# Altium schematic sheet MCU_CORE.SchDoc
size A2
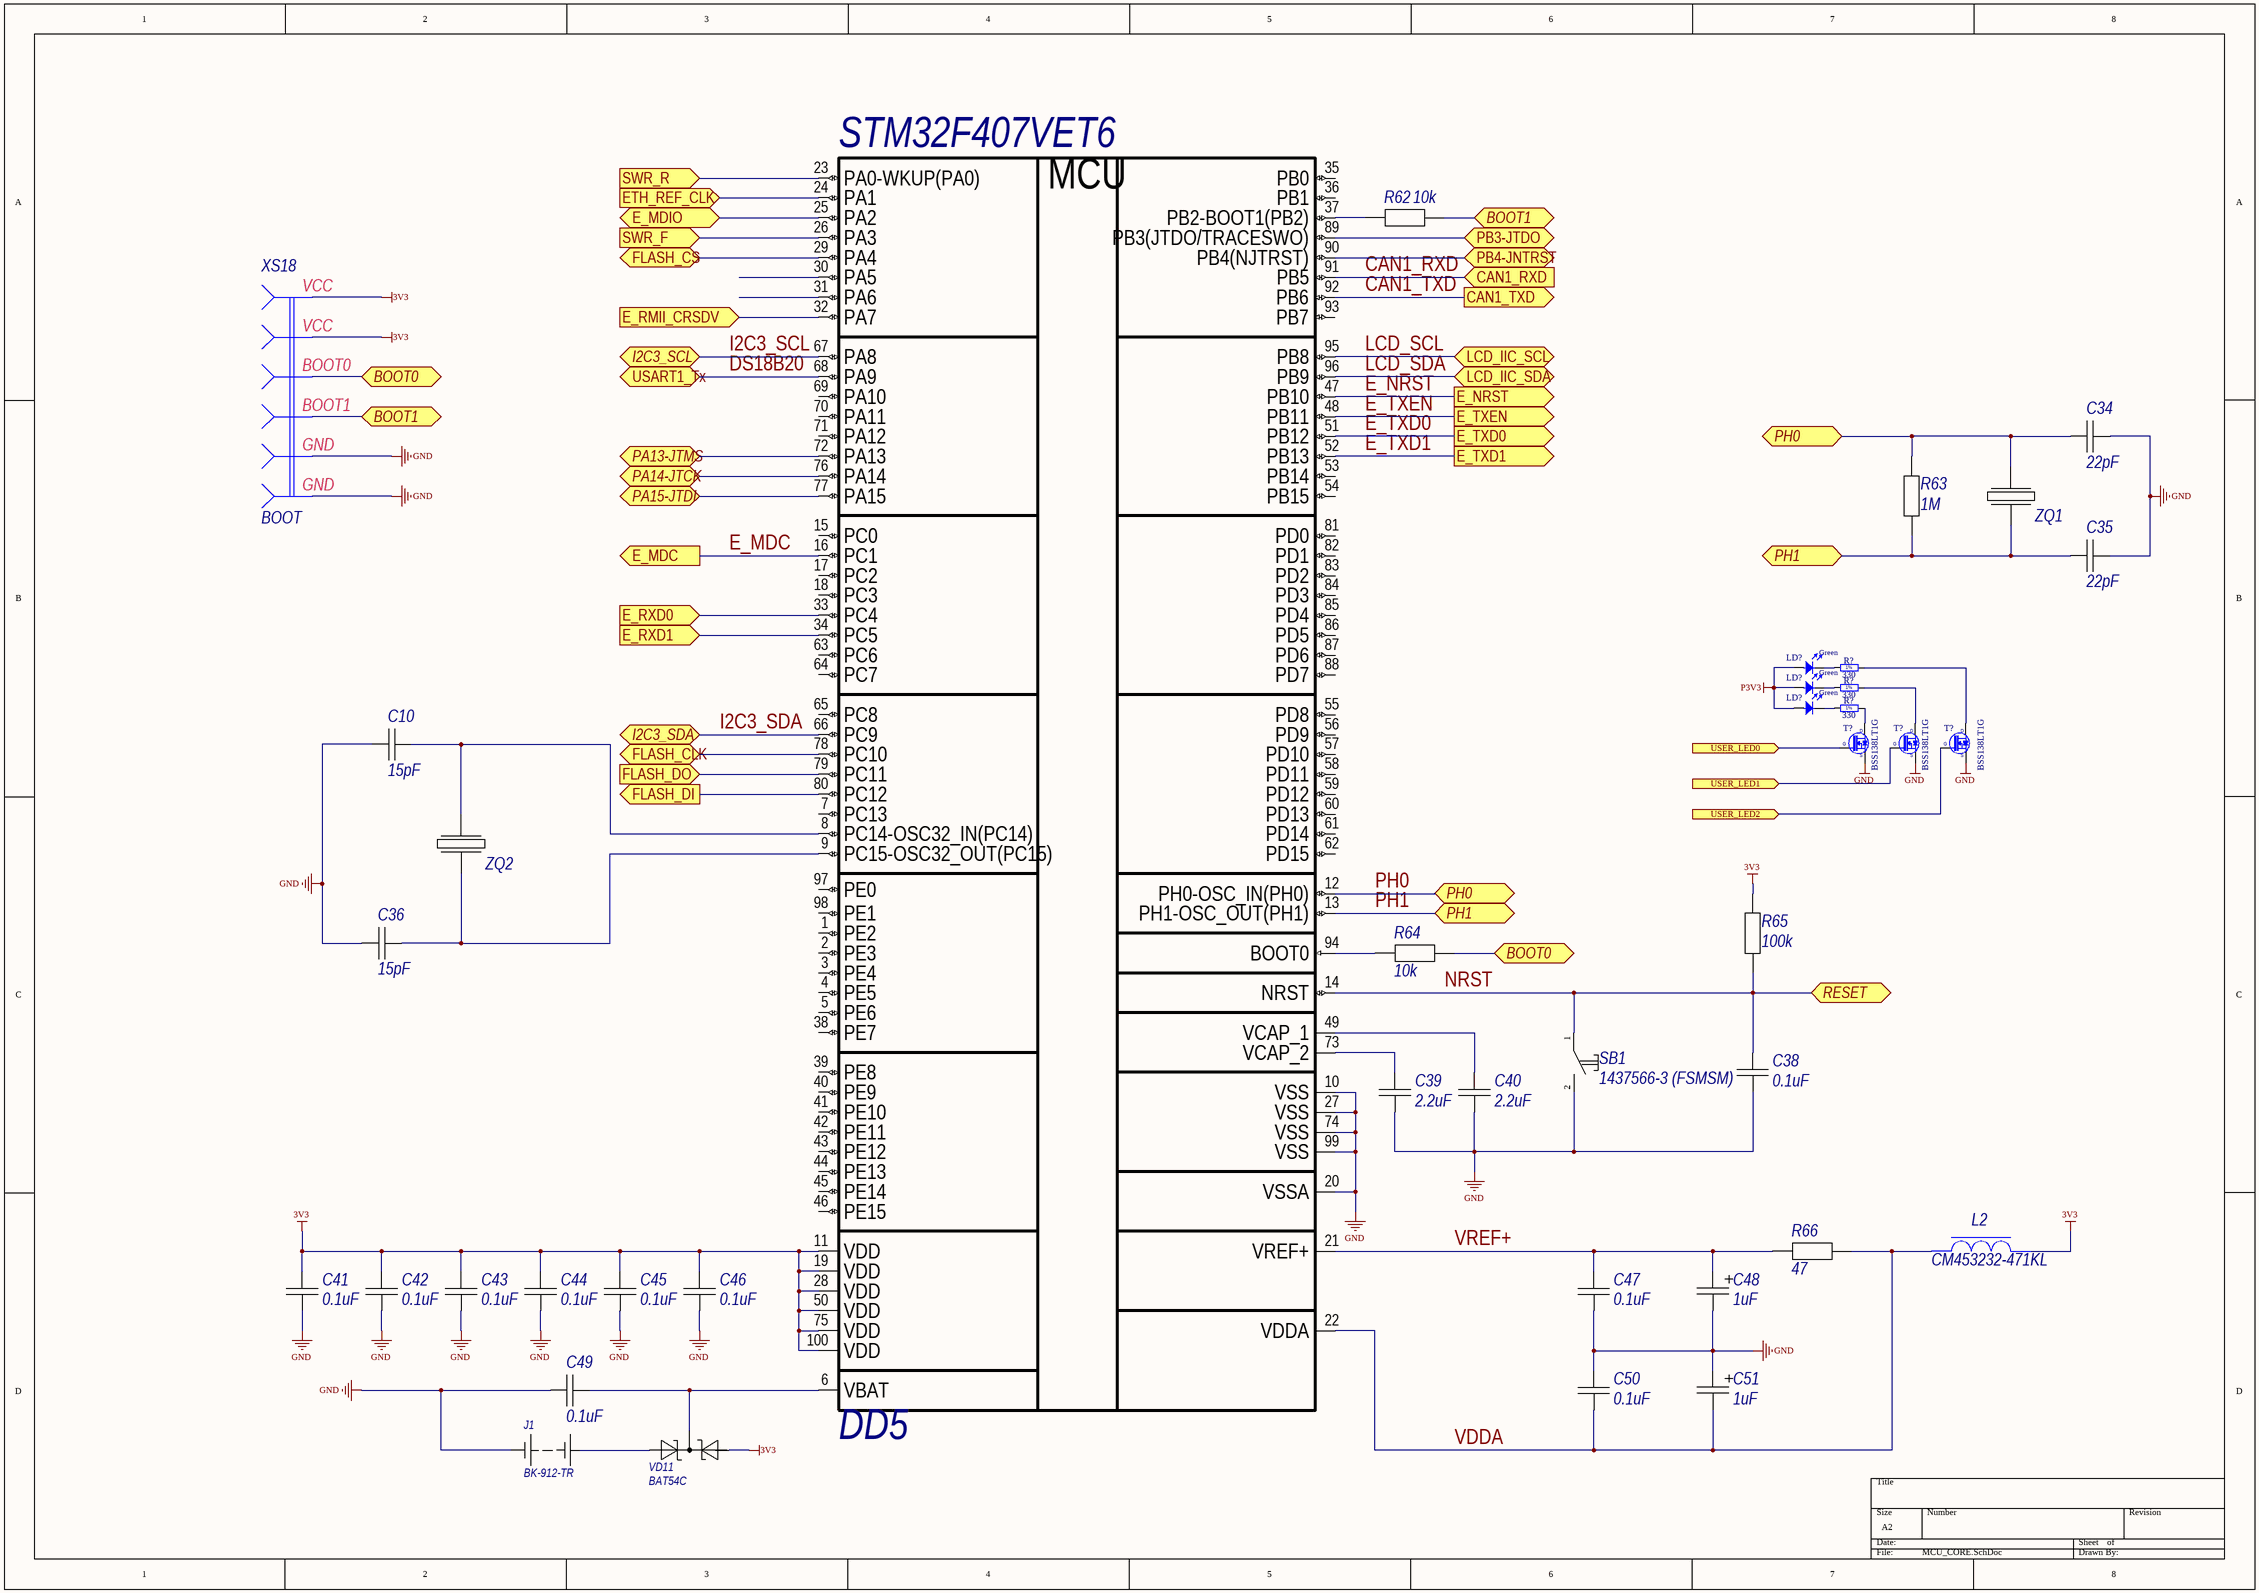
[diagram p0: MCU_CORE.SchDoc]

## Parts
(Parts that share a designator on the sheet are numbered #1, #2 ... from top to bottom, then left to right.)
C10  15pF  [C0805C]
C34  22pF  [C0805C]
C35  22pF  [C0805C]
C36  15pF  [C0805C]
C38  0.1uF  [C0805C]
C39  2.2uF  [C0805C]
C40  2.2uF  [C0805C]
C41  0.1uF  [C0805C]
C42  0.1uF  [C0805C]
C43  0.1uF  [C0805C]
C44  0.1uF  [C0805C]
C45  0.1uF  [C0805C]
C46  0.1uF  [C0805C]
C47  0.1uF  [C0805C]
C48  1uF  [TECAP_A]
C49  0.1uF  [C0805C]
C50  0.1uF  [C0805C]
C51  1uF  [TECAP_A]
DD5  STM32F407VET6  [STM-LQFP100_V]
J1  BK-912-TR  [BK-912-TR]
L2  CM453232-471KL  [INDPM4532]
LD?#1  Green  [LED_AVAGO_HSME-C110]
LD?#2  Green  [LED_AVAGO_HSME-C110]
LD?#3  Green  [LED_AVAGO_HSME-C110]
R62  10k  [C0805R]
R63  1M  [C0805R]
R64  10k  [C0805R]
R65  100k  [C0805R]
R66  47  [C0805R]
R?#1  330  [RESC1608X55N]
R?#2  330  [RESC1608X55N]
R?#3  330  [RESC1608X55N]
SB1  1437566-3 (FSMSM)  [1437566-3]
T?#1  BSS138LT1G  [SOT95P240X110-3N]
T?#2  BSS138LT1G  [SOT95P240X110-3N]
T?#3  BSS138LT1G  [SOT95P240X110-3N]
VD11  BAT54C  [BAT54C_SOT23-3]
XS18  BOOT  [PLD2-3]
ZQ1  HC49SM  [HC49SM]  (value not drawn)
ZQ2  FC135  [FC-135]  (value not drawn)

## Ports
BOOT0 (bidir), BOOT1 (bidir), CAN1_RXD (in), CAN1_TXD (out), E_MDC (out), E_MDIO (bidir), E_NRST (out), E_RMII_CRSDV (in), E_RXD0 (in), E_RXD1 (in), E_TXD0 (out), E_TXD1 (out), E_TXEN (out), ETH_REF_CLK (in), FLASH_CLK (bidir), FLASH_CS (bidir), FLASH_DI (out), FLASH_DO (in), I2C3_SCL (bidir), I2C3_SDA (bidir), LCD_IIC_SCL (bidir), LCD_IIC_SDA (bidir), PA13-JTMS (bidir), PA14-JTCK (bidir), PA15-JTDI (bidir), PB3-JTDO (bidir), PB4-JNTRST (bidir), PH0 (bidir), PH1 (bidir), RESET (bidir), SWR_F (in), SWR_R (in), USART1_Tx (bidir), USER_LED0 (in), USER_LED1 (in), USER_LED2 (in)

## Nets
3V3: C41.2 C42.2 C43.2 C44.2 C45.2 C46.2 DD5.11(VDD) DD5.19(VDD) DD5.28(VDD) DD5.50(VDD) DD5.75(VDD) DD5.100(VDD) L2.2 R65.1 VD11.2(C) XS18.1 XS18.2
GND: C10.1 C34.1 C35.1 C36.1 C38.1 C39.1 C40.1 C41.1 C42.1 C43.1 C44.1 C45.1 C46.1 C47.1 C48.2 C49.2 C50.2 C51.1 DD5.10(VSS) DD5.20(VSSA) DD5.27(VSS) DD5.74(VSS) DD5.99(VSS) J1.2(-) SB1.2 T?#1.2(S) T?#2.2(S) T?#3.2(S) XS18.5 XS18.6
P3V3: LD?#1.2(A) LD?#2.2(A) LD?#3.2(A)
BOOT0: R64.1 XS18.3 ; port BOOT0
BOOT1: R62.1 XS18.4 ; port BOOT1
CAN1_RXD: DD5.91(PB5) ; port CAN1_RXD
CAN1_TXD: DD5.92(PB6) ; port CAN1_TXD
DS18B20: DD5.68(PA9) ; port USART1_Tx
E_MDC: DD5.16(PC1) ; port E_MDC
E_MDIO: DD5.25(PA2) ; port E_MDIO
E_NRST: DD5.47(PB10) ; port E_NRST
E_RMII_CRSDV: DD5.32(PA7) ; port E_RMII_CRSDV
E_RXD0: DD5.33(PC4) ; port E_RXD0
E_RXD1: DD5.34(PC5) ; port E_RXD1
E_TXD0: DD5.51(PB12) ; port E_TXD0
E_TXD1: DD5.52(PB13) ; port E_TXD1
E_TXEN: DD5.48(PB11) ; port E_TXEN
ETH_REF_CLK: DD5.24(PA1) ; port ETH_REF_CLK
FLASH_CLK: DD5.78(PC10) ; port FLASH_CLK
FLASH_CS: DD5.29(PA4) ; port FLASH_CS
FLASH_DI: DD5.80(PC12) ; port FLASH_DI
FLASH_DO: DD5.79(PC11) ; port FLASH_DO
I2C3_SCL: DD5.67(PA8) ; port I2C3_SCL
I2C3_SDA: DD5.66(PC9) ; port I2C3_SDA
LCD_SCL: DD5.95(PB8) ; port LCD_IIC_SCL
LCD_SDA: DD5.96(PB9) ; port LCD_IIC_SDA
NRST: C38.2 DD5.14(NRST) R65.2 SB1.1 ; port RESET
PA13-JTMS: DD5.72(PA13) ; port PA13-JTMS
PA14-JTCK: DD5.76(PA14) ; port PA14-JTCK
PA15-JTDI: DD5.77(PA15) ; port PA15-JTDI
PB3-JTDO: DD5.89(PB3(JTDO/TRACESWO)) ; port PB3-JTDO
PB4-JNTRST: DD5.90(PB4(NJTRST)) ; port PB4-JNTRST
PH0: C34.2 DD5.12(PH0-OSC_IN(PH0)) R63.1 ZQ1.2 ; port PH0
PH1: C35.2 DD5.13(PH1-OSC_OUT(PH1)) R63.2 ZQ1.1 ; port PH1
SWR_F: DD5.26(PA3) ; port SWR_F
SWR_R: DD5.23(PA0-WKUP(PA0)) ; port SWR_R
USER_LED0: T?#1.1(G) ; port USER_LED0
USER_LED1: T?#2.1(G) ; port USER_LED1
USER_LED2: T?#3.1(G) ; port USER_LED2
VDDA: C50.1 C51.2 DD5.22(VDDA) L2.1 R66.1
VREF+: C47.2 C48.1 DD5.21(VREF+) R66.2
NetC10_2: C10.2 DD5.8(PC14-OSC32_IN(PC14)) ZQ2.2
NetC36_2: C36.2 DD5.9(PC15-OSC32_OUT(PC15)) ZQ2.1
NetC39_2: C39.2 DD5.73(VCAP_2)
NetC40_2: C40.2 DD5.49(VCAP_1)
NetC49_1: C49.1 DD5.6(VBAT) VD11.3(AC)
NetDD5_37: DD5.37(PB2-BOOT1(PB2)) R62.2
NetDD5_94: DD5.94(BOOT0) R64.2
NetJ1_1: J1.1(+) VD11.1(А1)
NetLD?#1_1: LD?#1.1(C) R?#1.1
NetLD?#2_1: LD?#2.1(C) R?#2.1
NetLD?#3_1: LD?#3.1(C) R?#3.1
NetR?#1_2: R?#1.2 T?#3.3(D)
NetR?#2_2: R?#2.2 T?#2.3(D)
NetR?#3_2: R?#3.2 T?#1.3(D)

Not connected (* = marked no-connect by the designer): DD5 1(PE2) 2(PE3) 3(PE4) 4(PE5) 5(PE6) 7(PC13) 15(PC0) 17(PC2) 18(PC3) 30(PA5) 31(PA6) 35(PB0) 36(PB1) 38(PE7) 39(PE8) 40(PE9) 41(PE10) 42(PE11) 43(PE12) 44(PE13) 45(PE14) 46(PE15) 53(PB14) 54(PB15) 55(PD8) 56(PD9) 57(PD10) 58(PD11) 59(PD12) 60(PD13) 61(PD14) 62(PD15) 63(PC6) 64(PC7) 65(PC8) 69(PA10) 70(PA11) 71(PA12) 81(PD0) 82(PD1) 83(PD2) 84(PD3) 85(PD4) 86(PD5) 87(PD6) 88(PD7) 93(PB7) 97(PE0) 98(PE1)

## Notes on the sheet
- (in symbol CONNECT_BOOT) VCC; BOOT0; BOOT1; GND
- (in symbol R0603_330R_1%_0.1W_100PPM) 1%
- (in symbol STM32F407VET6) MCU

## Library data of the parts
C10 C34-C36 C38-C47 C49 C50 = CAP_0805: Type: Конденсатор; Published: 18.05.2010; Publisher: Andrew Danich
C48 C51 = CAP_TECAP_A: Type: Конденсатор; Published: 20.08.2010; Publisher: Andrew Danich
DD5 = STM32F407VET6: ARM Cortex-M4 32-bit MCU+FPU, 210 DMIPS, 512 kB Flash, 192 kB Internal RAM, 82 I/Os, 100-pin LQFP, -40 to 85 degC, Tray; Manufacturer: STMicroelectronics; D/A Converter: 2x12-bit; FLASH Size (Prog) (kB): 512; I/Os (High Current): 82; Internal RAM Size (kB): 192; Operating Frequency(F) (Processor speed) (MHz): 168; Supply Voltage(Vcc) max (V): 3.6; Supply Voltage(Vcc) min (V): 1.8; DatasheetVersion: Rev. 4; PackageVersion: Rev. 1, 06/2013; PackageReference: LQFP100; PackageDescription: 100-Pin Low Profile Quad Flat Package, 14 x 14 mm Body, 0.5 mm Pitch; Supplier 1: Digi-Key; Supplier Part Number 1: 497-12075-ND; Supplier 2: Farnell; Supplier Part Number 2: 2064367; Supplier 3: Newark; Supplier Part Number 3: 73T2332; Supplier 4: Mouser; Supplier Part Number 4: 511-STM32F407VET6; Core: ARM Cortex-M4; Packing: Tray; Mounting Technology: Surface Mount; PartNumber: STM32F407VET6; ComponentLink1Description: Manufacturer URL; ComponentLink1URL: http://www.st.com/web/en/home.html; ComponentLink2Description: Datasheet; ComponentLink2URL: http://www.st.com/st-web-ui/static/active/en/resource/technical/document/datasheet/DM00037051.pdf; ComponentLink3Description: Package Specification; ComponentLink3URL: http://www.st.com/st-web-ui/static/active/en/resource/technical/document/data_brief/DM00071938.pdf
J1 = BK-912-TR: Holder Coin Cell 20mm Smd
L2 = CM453232-471KL: Type: Дроссель; Published: 20.05.2010; Publisher: Andrew Danich
LD?#1-LD?#3 = LED_AVAGO_HSME-C110: LED Green 1C 2A; Part Description: High Performance Right Angle Chip Green LED; Manufacturer: AVAGO TECHNOLOGIES; PressFit: No; Bonding: No; Part Number: LED_AVAGO_HSME-C110; Component Kind: Standard; Component Type: Standard; Color: Green; PackageDescription: Green Chip LED, 2-Leads, Body 3.3x1.6mm, Side Emitting Package; Manufacturer Part Number: HSME-C110; Pin Count: 2; Mounted: Yes; Socket: No; SMD: Yes; Sense: No; ComponentHeight: 1.1mm; HelpURL: \\cern.ch\dfs\Applications\Altium\Datasheets\LED_AVAGO_HSME-C110.pdf; ComponentLink1URL: \\cern.ch\dfs\Applications\Altium\Datasheets\LED_AVAGO_HSME-C110_DESIGN-GUIDE.pdf; ComponentLink1Description: Design Guide; Author: CERN DEM JMW; CreateDate: 30.07.2009; LatestRevisionDate: 20.06.2012
R62-R66 = RES_0805: Published: 24.03.2010; Publisher: Andrew Danich; Type: Резистор
R?#1-R?#3 = R0603_330R_1%_0.1W_100PPM: Resistor - 1%; Part Description: General Purpose Thick Film Chip Resistor; Manufacturer: GENERIC; Manufacturer1 Part Number: NRC06F3300TRF; Power: 0.1W; TC: ±100ppm/°C; PressFit: No; Part Number: R0603_330R_1%_0.1W_100PPM; Component Kind: Standard; Component Type: Standard; Pin Count: 2; Value: 330; Status: Preferred; Tolerance: ±1%; Manufacturer Part Number: R0603_330R_1%_0.1W_100PPM; Case: 0603; Mounted: Yes; Socket: No; SMD: Yes; Manufacturer1 Example: NIC COMPONENT; Manufacturer1 ComponentHeight: 0.55mm; HelpURL: \\cern.ch\dfs\Applications\Altium\Datasheets\R0603_NIC_NRC.pdf; Author: CERN DEM JLC; CreateDate: 03-Dec-07; LatestRevisionDate: 13-Mar-08; Sense: No
SB1 = BT-01x-01p: Published: 17.04.2014; Publisher: Andrew Danich; Type: Переключатель
T?#1-T?#3 = BSS138LT1G: N-CHANNEL MOSFET WITH DIODE; Part Description: 50V 200mA N-Channel Enhancement Mode Field-Effect Transistor; Manufacturer: ON SEMICONDUCTOR; PressFit: No; Bonding: No; Part Number: BSS138LT1G; Component Kind: Standard; Component Type: Standard; Device: BSS138LT1G; PackageDescription: SOT23 3-Leads, Pitch 0.95mm - Body 1.4x3mm, IPC Medium Density; Manufacturer Part Number: BSS138LT1G; Pin Count: 3; Case: SOT23-3; Mounted: Yes; Socket: No; SMD: Yes; Sense: No; ComponentHeight: 1.11mm; HelpURL: \\cern.ch\dfs\Applications\Altium\Datasheets\BSS138LT1G.pdf; Author: CERN DEM JLC; CreateDate: 23-Mar-09; LatestRevisionDate: 23-Mar-09
VD11 = BAT54C: Small Signal Schottky Diode, Dual Common Cathode, 30 V, 200 mA, 400 mV, 600 mA, 125 C
XS18 = CONNECT_BOOT: Value: Connector; Published: 07.03.2013; Publisher: Andrew Danich; Type: Розетка
ZQ1 = HC49SM: Published: 08.03.2013; Publisher: Andrew Danich; Type: Резонатор
ZQ2 = FC135: Published: 08.03.2013; Publisher: Andrew Danich; Type: Резонатор